# EAGLE design Coulomb Counter Test Board (EAGLE 7.6.0)
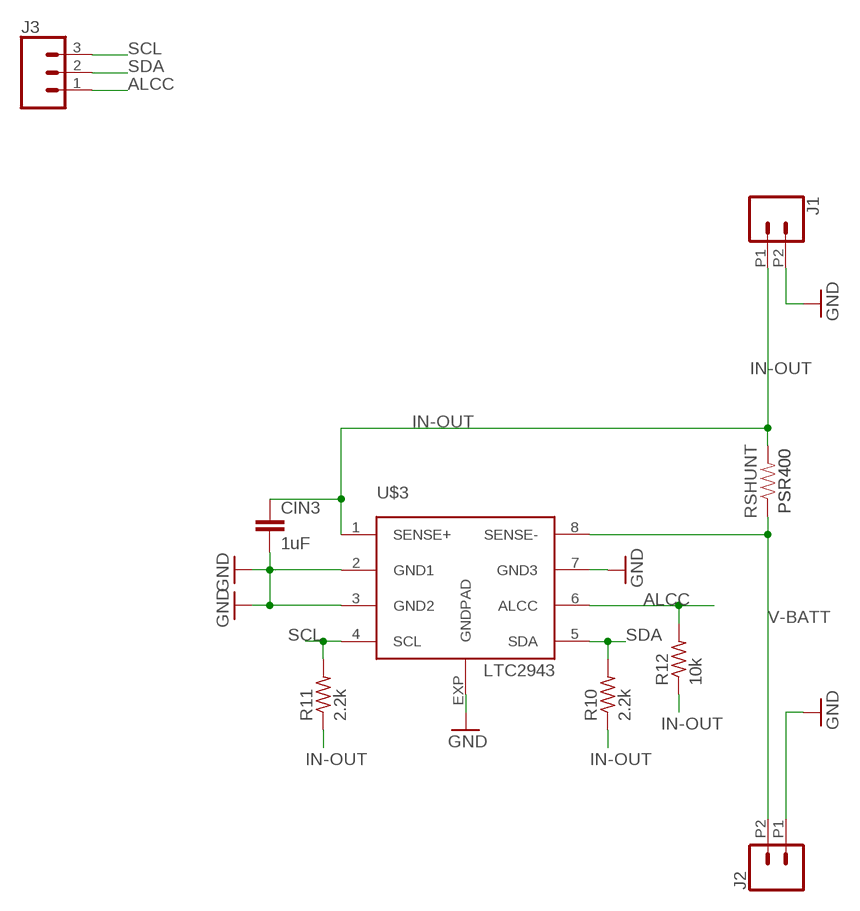
[diagram p0: schematic, sheet 1]

## Parts
CIN3  1uF  .1UF-CER  [0402-CAP]
J1  CONN_022.54MM_SCREWTERM  [1X02_2.54_SCREWTERM]
J2  CONN_022.54MM_SCREWTERM  [1X02_2.54_SCREWTERM]
J3  CONN_03  [1X03]
R10  2.2k  R-US_R0805  [R0805]
R11  2.2k  R-US_R0805  [R0805]
R12  10k  R-US_R0805  [R0805]
RSHUNT  PSR400  [PSR400]
U$3  LTC2943  [DFN8(3X3)LT]

## Nets
ALCC: J3.1 R12.2 U$3.6(ALCC)
GND: CIN3.2 J1.P2 J2.P1 U$3.2(GND1) U$3.3(GND2) U$3.7(GND3) U$3.EXP(GNDPAD)
IN-OUT: CIN3.1 J1.P1 R10.1 R11.1 R12.1 RSHUNT.P$2 U$3.1(SENSE+)
SCL: J3.3 R11.2 U$3.4(SCL)
SDA: J3.2 R10.2 U$3.5(SDA)
V-BATT: J2.P2 RSHUNT.P$1 U$3.8(SENSE-)

## Library data of the parts
CIN3 = SparkFun-Retired:.1UF-CER: .1uF ceramic SMT CAP-00810- 25V +80%/-20% (0603) CAP-08390- 100V 10% (0603) CAP-08604- 25V 5% (0603); PROD_ID: CAP-00810; VALUE: 0.1uF
J1 J2 = SparkFun-Connectors:CONN_02: Multi connection point. Often used as Generic Header-pin footprint for 0.1 inch spaced/style header connections On any of the 0.1 inch spaced packages, you can populate with these: Break Away Headers - Straight <https://www.sparkfun.com/products/116> (PRT-00116) Break Away Male Headers - Right Angle <https://www.sparkfun.com/products/553> (PRT-00553) Female Headers <https://www.sparkfun.com/products/115> (PRT-00115) Break Away Headers - Machine Pin <https://www.sparkfun.com/products/117> (PRT-00117) Break Away Female Headers - Swiss Machine Pin <https://www.sparkfun.com/products/743> (PRT-00743) For SCREWTERMINALS and SPRING TERMINALS visit here: Screw Terimnals on SparkFun.com <https://www.sparkfun.com/search/results?term=Screw+Terminals> (5mm/3.5mm/2.54mm spacing) This device is also useful as a general connection point to wire up your design to another part of your project. Our various solder wires solder well into these plated through hole pads. Hook-Up Wire - Assortment (Stranded, 22 AWG) <https://www.sparkfun.com/products/11375> (PRT-11375) Hook-Up Wire - Assortment (Solid Core, 22 AWG) <https://www.sparkfun.com/products/11367> (PRT-11367) View the entire wire category on our website here <https://www.sparkfun.com/categories/141> Special notes: Molex polarized connector foot print use with: PRT-08233 with associated crimp pins and housings. 2.54_SCREWTERM for use with PRT-10571. 3.5mm Screw Terminal footprints for PRT-08084 5mm Screw Terminal footprints for use with PRT-08432
J3 = SparkFun-Connectors:CONN_03: Multi connection point. Often used as Generic Header-pin footprint for 0.1 inch spaced/style header connections On any of the 0.1 inch spaced packages, you can populate with these: Break Away Headers - Straight <https://www.sparkfun.com/products/116> (PRT-00116) Break Away Male Headers - Right Angle <https://www.sparkfun.com/products/553> (PRT-00553) Female Headers <https://www.sparkfun.com/products/115> (PRT-00115) Break Away Headers - Machine Pin <https://www.sparkfun.com/products/117> (PRT-00117) Break Away Female Headers - Swiss Machine Pin <https://www.sparkfun.com/products/743> (PRT-00743) Stackable Header - 3 Pin (Female, 0.1") <https://www.sparkfun.com/products/13875> (PRT-13875) For SCREWTERMINALS and SPRING TERMINALS visit here: Screw Terimnals on SparkFun.com <https://www.sparkfun.com/search/results?term=Screw+Terminals> (5mm/3.5mm/2.54mm spacing) This device is also useful as a general connection point to wire up your design to another part of your project. Our various solder wires solder well into these plated through hole pads. Hook-Up Wire - Assortment (Stranded, 22 AWG) <https://www.sparkfun.com/products/11375> (PRT-11375) Hook-Up Wire - Assortment (Solid Core, 22 AWG) <https://www.sparkfun.com/products/11367> (PRT-11367) View the entire wire category on our website here <https://www.sparkfun.com/categories/141> Special notes: Molex polarized connector foot print use with SKU : PRT-08232 with associated crimp pins and housings.
R10-R12 = rcl:R-US_: RESISTOR, American symbol
RSHUNT = Parts for Power Team1:PSR400
U$3 = Parts for Power Team1:LTC2943

## Board
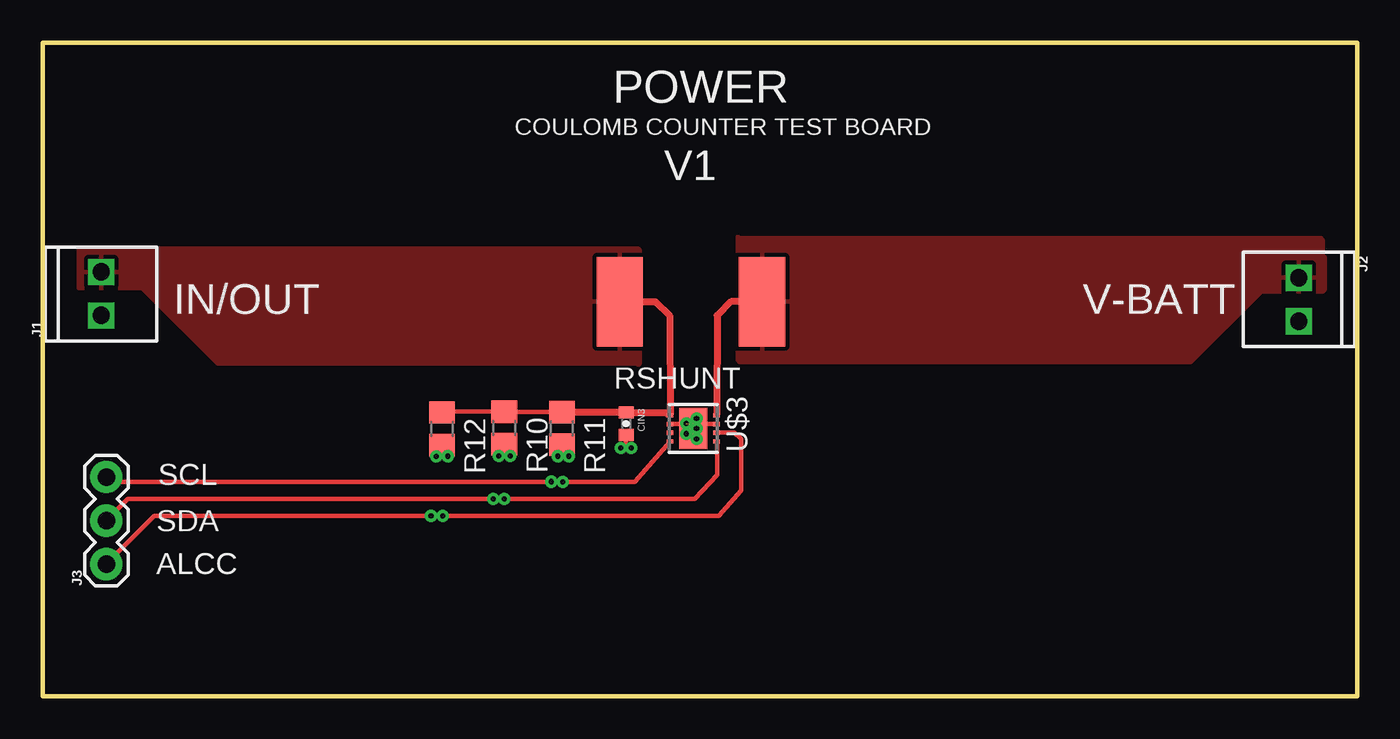
[diagram p1: board, top side]
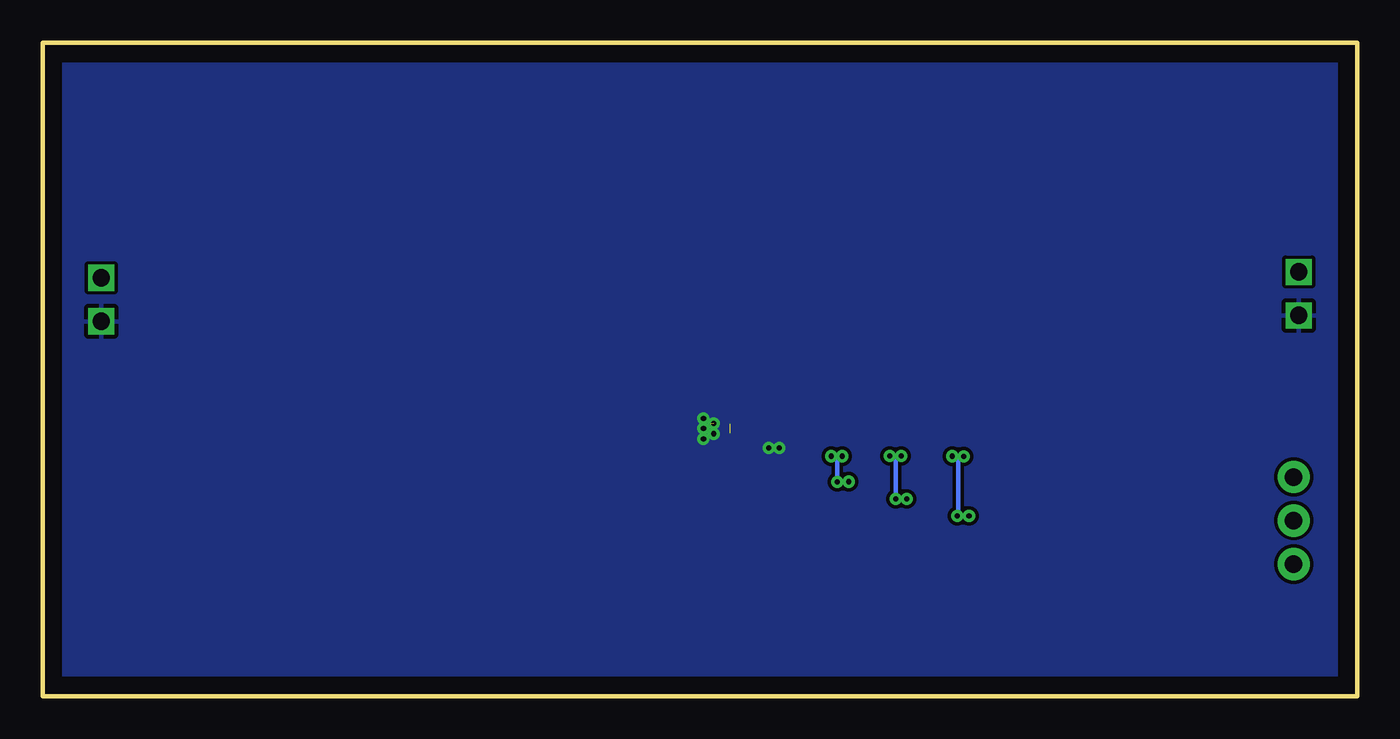
[diagram p2: board, bottom side, seen from below]

Size 76.6 x 38.1 mm. Coordinates in mm from the lower left corner, seen from the top.
Outline: 0,0 76.6,0 76.6,38.1 0,38.1 0,0
Copper layers (1*16): Top 0.035mm / dielectric 1.5mm / Bottom 0.035mm
Design rules "default": minimum track width 10mil, minimum drill 24mil, track to track 8mil, track to pad 8mil, pad to pad 8mil, via to via 8mil, smd to smd 8mil, copper to edge 40mil, drill to drill 8mil, minimum pad ring 10mil, minimum via ring 8mil, stop-mask expansion 4mil, vias tented up to drill 0mil, thermal gap 10mil

### Footprints (pad centres in the part's own frame; a part is rotated, then mirrored left to right if it is on the bottom)
0402-CAP = smd 0.7 x 0.9: 1 -0.65,0; 2 0.65,0
1X02_2.54_SCREWTERM = drill 1.016 square: P1 2.54,0; P2 0,0
1X03 = drill 1.016 pad 1.88: 1 0,0; 2 2.54,0; 3 5.08,0
R0805 = smd 1.3 x 1.5: 1 -0.95,0; 2 0.95,0
PSR400 = smd 2.7 x 5.2: P$1 0,0; P$2 8.3,0
DFN8(3X3)LT = smd 0.25 x 0.45: 1 -2.02,-0.08; 2 -1.52,-0.08; 3 -1.02,-0.08; 4 -0.52,-0.08; 5 -0.52,2.62; 6 -1.02,2.62; 7 -1.52,2.62; 8 -2.02,2.62 | smd 2.38 x 1.65: EXP -1.27,1.27

### Placement (x,y rotation side)
CIN3  34,15.88 270 top
J1  3.4,22.2 90 top
J2  73.2,24.4 270 top
J3  3.7,7.7 90 top
R10  26.89,15.64 270 top
R11  30.25,15.61 270 top
R12  23.26,15.59 270 top
RSHUNT  41.92,23 180 top
U$3  36.64,14.34 270 top

### Tracks (layer width: path | path; a pad name or v marks a point on that pad's centre or on a via)
ALCC  (via drill 0.3)
  Top 0.254: U$3.6 39.3,15.36 40.3,15.36 40.7,15 40.7,12 39.4,10.5 v23.3,10.5 6.5,10.5 J3.1 | R12.2 23.26,14.32 v22.93,13.98
  Bottom 0.254: v22.93,13.98 23.23,13.98 | 23.23,13.98 v23.59,13.98 v23.59,13.99 | 23.23,13.98 23.23,10.57 v23.3,10.5 v22.62,10.5 v22.62,10.51
GND  (via drill 0.3)  (2 unrouted)
  Top 0.254: U$3.3 | U$3.7 38.16,15.86 | 38.16,15.86 U$3.EXP 37.66,15.86 U$3.2 | 38.16,15.86 37.9,15.86 37.9,16.2 | CIN3.2 33.98,15.23 33.98,14.62 v34.29,14.48
  other vias: 38.1,16.2 37.5,15.9 37.5,15.3 38.1,15.6 38.1,15 33.69,14.48
  pour Bottom: 0.1,38.1 0.1,0.1 76.6,0.1 76.6,38 76.5,38.1 0.3,38.1
IN-OUT
  Top 0.254: R11.1 26.92,16.56 R10.1 23.31,16.59 R12.1 | 36.39,16.53 36.39,16.36 U$3.1 36.56,16.43 36.55,16.43
  Top 0.406: RSHUNT.P$2 35.7,23 36.52,22.19 36.55,16.43 | 36.39,16.53 CIN3.1 30.28,16.53 R11.1
  pour Top: 34.7,19.4 10.2,19.4 5.8,23.8 2.1,23.8 2.1,26.1 34.7,26.1 34.8,26 34.8,19.4 34.7,19.3
N$1  (via drill 0.3)
  other vias: 29.63,12.5
SCL  (via drill 0.3)
  Top 0.254: J3.3 arc90 3.98,12.5 v30.3,12.5 34.5,12.5 U$3.4 | R11.2 30.25,14.23 v30.01,13.99
  Bottom 0.254: 29.6,12.48 29.61,12.5 v30.3,12.5 v30.29,12.51 30.29,13.99 | 29.6,12.48 | 29.6,12.48 29.63,12.45 | v30.01,13.99 30.29,13.99 | 30.29,13.99 v30.65,13.99 v30.66,13.99
SDA  (via drill 0.3)
  Top 0.254: U$3.5 39.3,14.82 39.3,12.9 38,11.5 v26.9,11.5 4.96,11.5 J3.2 | R10.2 26.89,14.35 v27.24,14
  Bottom 0.254: v27.24,14 26.9,14 | 26.9,14 v26.57,14 | 26.9,14 v26.9,11.5 | v26.9,11.5 | v26.9,11.5 v26.24,11.5
V-BATT
  Top 0.254: U$3.8 39.28,16.36 39.28,16.46
  Top 0.406: RSHUNT.P$1 40.1,23 39.3,22.2 39.28,16.46
  pour Top: 40.6,19.5 66.9,19.5 71,23.6 74.6,23.6 74.7,23.7 74.7,25.6 74.6,25.7 74.6,26.2 74.6,26.6 74.5,26.7 40.6,26.7 40.5,26.8 40.5,19.6

### Text on the board
tSilk: POWER | COULOMB COUNTER TEST BOARD | V1 | IN/OUT | V-BATT | SCL | SDA | ALCC